# Altium schematic sheet FPGA.SchDoc
size A3; DocumentNumber: 4; Revision: B; SheetNumber: 4; SheetTotal: 7; SheetTitle: FPGA ICE40LP; Designer: DM; Reviewer: -
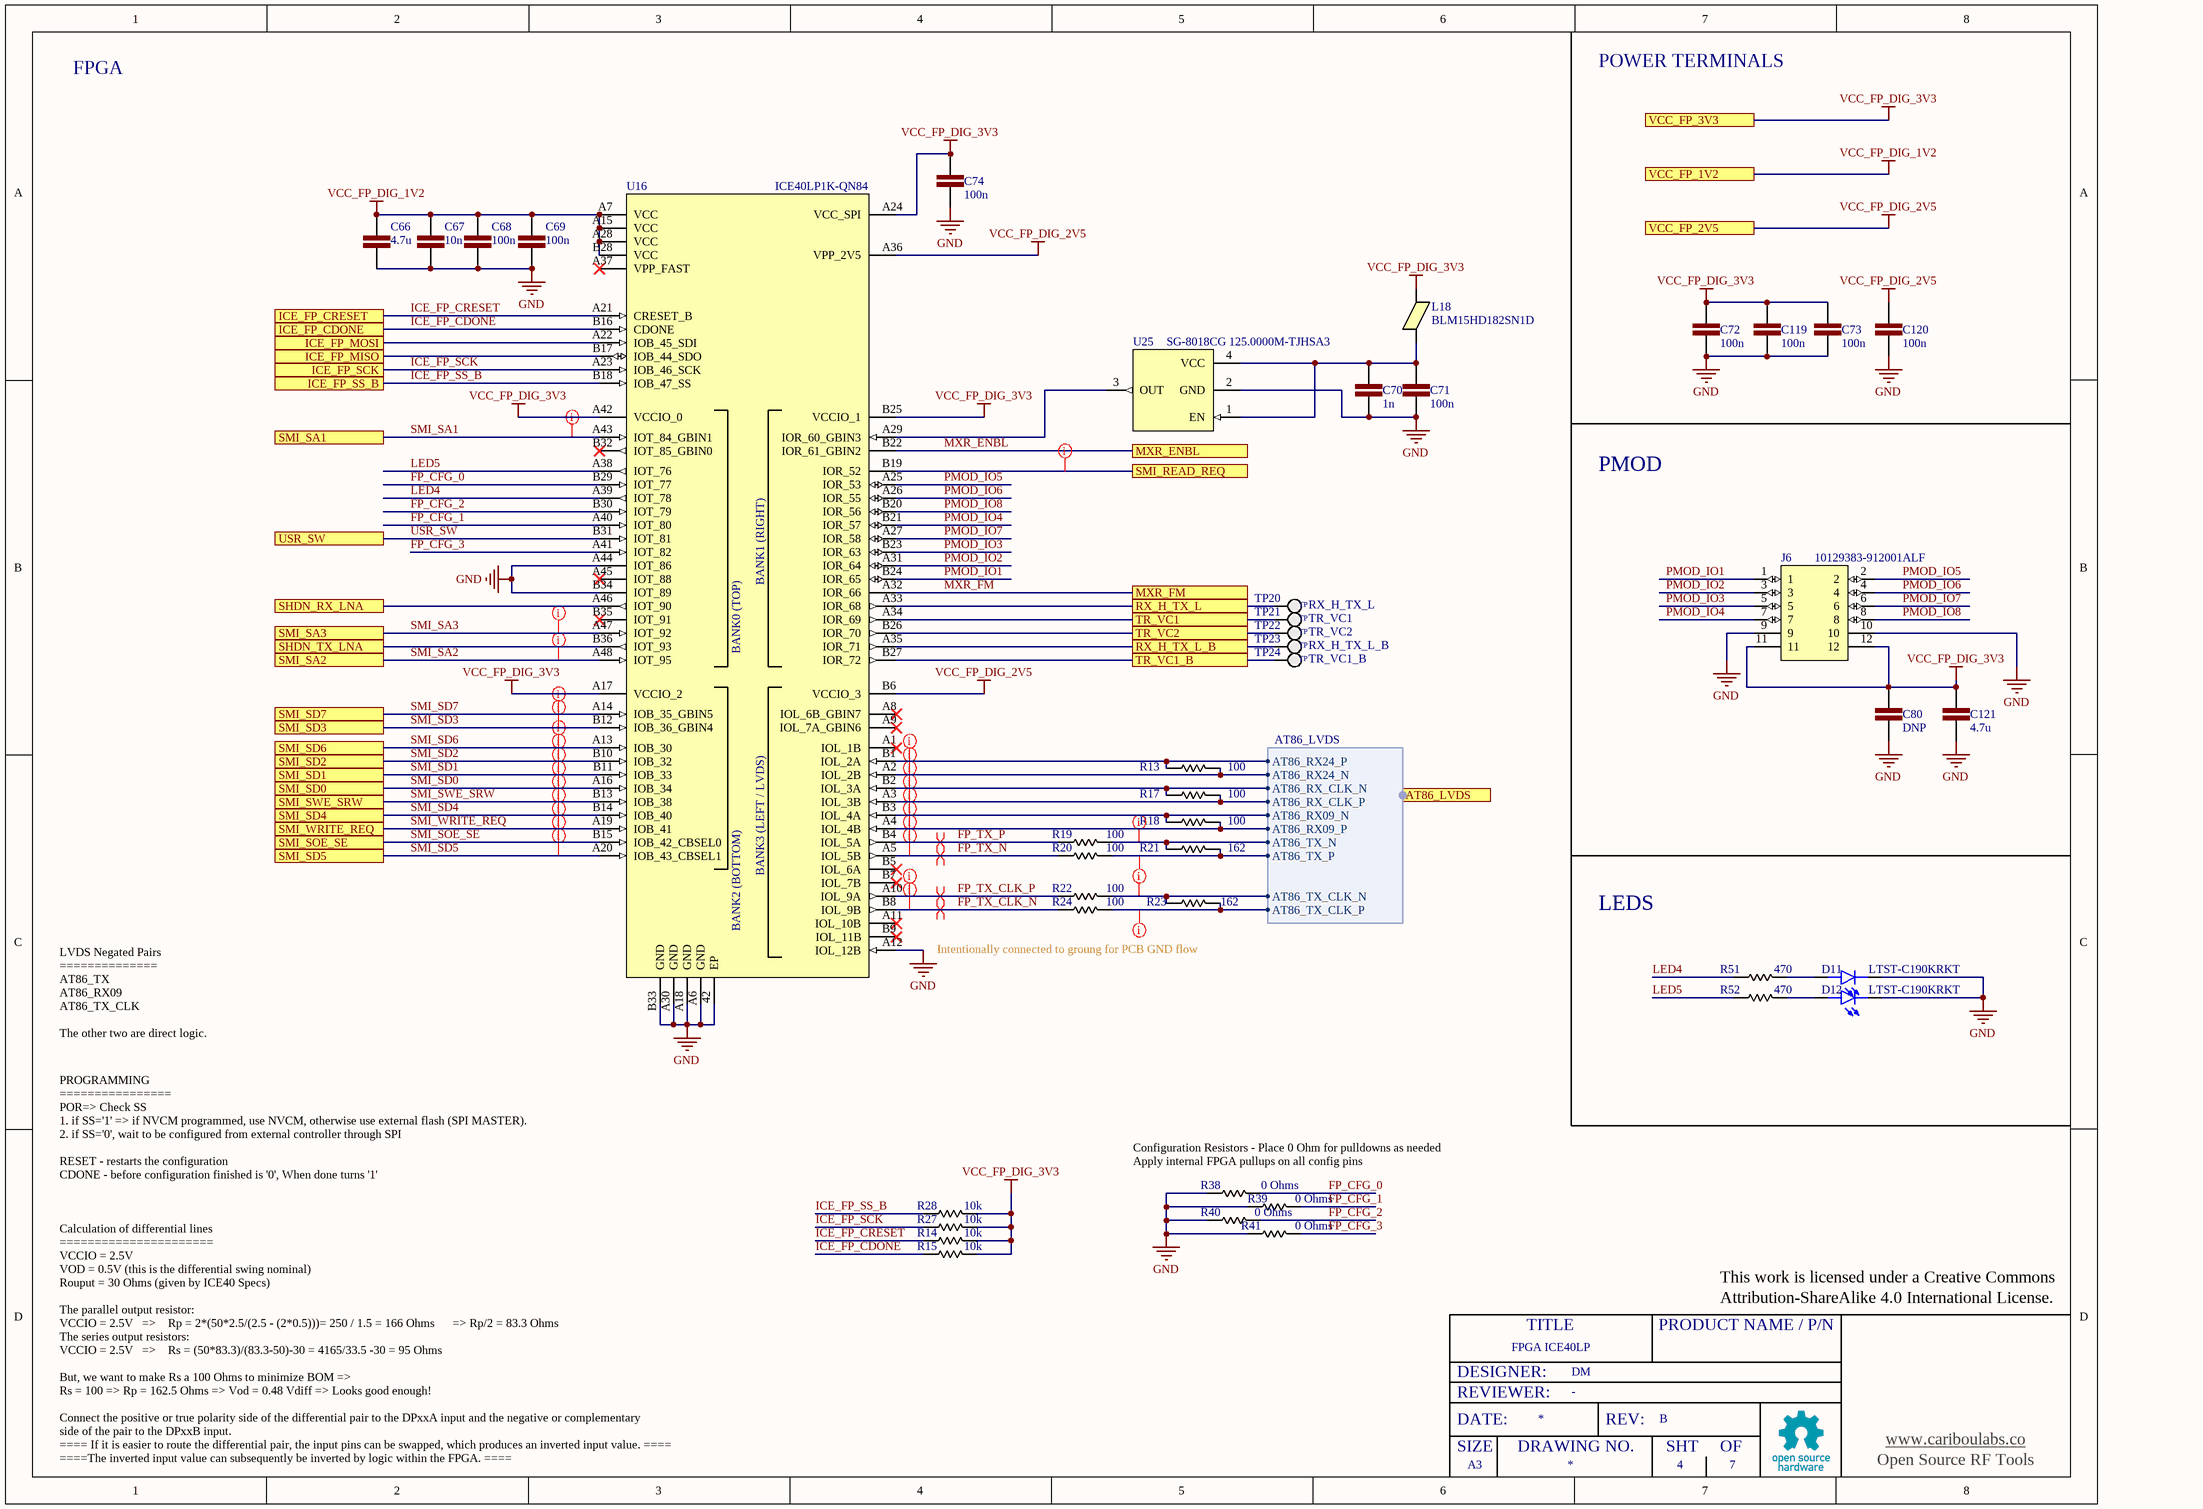
[diagram p0: FPGA.SchDoc]

## Parts
C66  4.7u  [MURATA 0402]
C67  10n  [MURATA 0402]
C68  100n  [MURATA 0402]
C69  100n  [MURATA 0402]
C70  1n  [MURATA 0402]
C71  100n  [MURATA 0402]
C72  100n  [MURATA 0402]
C73  100n  [MURATA 0402]
C74  100n  [MURATA 0402]
C80  DNP  [MURATA 0402]
C119  100n  [MURATA 0402]
C120  100n  [MURATA 0402]
C121  4.7u  [MURATA 0402]
D11  LTST-C190KRKT  [LEDC1608X35N]
D12  LTST-C190KRKT  [LEDC1608X35N]
J6  10129383-912001ALF  [10129383912001ALF]
L18  BLM15HD182SN1D  [0402 FERRITE BEAD]
R13  100  [PANASONIC 0402]
R14  10k  [PANASONIC 0402]
R15  10k  [PANASONIC 0402]
R17  100  [PANASONIC 0402]
R18  100  [PANASONIC 0402]
R19  100  [PANASONIC 0402]
R20  100  [PANASONIC 0402]
R21  162  [PANASONIC 0402]
R22  100  [PANASONIC 0402]
R23  162  [PANASONIC 0402]
R24  100  [PANASONIC 0402]
R27  10k  [PANASONIC 0402]
R28  10k  [PANASONIC 0402]
R38  0 Ohms  [PANASONIC 0402]
R39  0 Ohms  [PANASONIC 0402]
R40  0 Ohms  [PANASONIC 0402]
R41  0 Ohms  [PANASONIC 0402]
R51  470  [PANASONIC 0402]
R52  470  [PANASONIC 0402]
TP20  RX_H_TX_L  [TP_40]
TP21  TR_VC1  [TP_40]
TP22  TR_VC2  [TP_40]
TP23  RX_H_TX_L_B  [TP_40]
TP24  TR_VC1_B  [TP_40]
U16  ICE40LP1K-QN84  [LATTICE_ICE40LP1K-QN84]
U25  Manu. P/N: SG-8018CG 125.0000M-TJHSA3  [SG-8018CG]  (hidden comment: SG-8018CG 125.0000M-TJHPA3)

## Ports
AT86_LVDS (harness AT86_LVDS), ICE_FP_CDONE, ICE_FP_CRESET, ICE_FP_MISO, ICE_FP_MOSI, ICE_FP_SCK, ICE_FP_SS_B, MXR_ENBL, MXR_FM, RX_H_TX_L, RX_H_TX_L_B, SHDN_RX_LNA, SHDN_TX_LNA, SMI_READ_REQ, SMI_SA1, SMI_SA2, SMI_SA3, SMI_SD0, SMI_SD1, SMI_SD2, SMI_SD3, SMI_SD4, SMI_SD5, SMI_SD6, SMI_SD7, SMI_SOE_SE, SMI_SWE_SRW, SMI_WRITE_REQ, TR_VC1, TR_VC1_B, TR_VC2, USR_SW, VCC_FP_1V2, VCC_FP_2V5, VCC_FP_3V3

## Harnesses
AT86_LVDS: AT86_RX24_P, AT86_RX24_N, AT86_TX_P, AT86_TX_N, AT86_RX09_P, AT86_RX09_N, AT86_TX_CLK_N, AT86_TX_CLK_P, AT86_RX_CLK_P, AT86_RX_CLK_N

## Nets
GND: C66.2 C67.2 C68.1 C69.1 C70.1 C71.1 C72.2 C73.1 C74.1 C80.2 C119.2 C120.1 C121.2 D11.C D12.C J6.9 J6.10 R38.2 R39.2 R40.2 R41.2 U16.42(EP) U16.A6(GND) U16.A12(IOL_12B) U16.A18(GND) U16.A30(GND) U16.A44(IOT_86) U16.B33(GND) U16.B34(IOT_89) U25.2(GND)
VCC_FP_DIG_1V2: C66.1 C67.1 C68.2 C69.2 U16.A7(VCC) U16.A15(VCC) U16.A28(VCC) U16.B28(VCC) ; port VCC_FP_1V2
VCC_FP_DIG_2V5: C120.2 U16.A36(VPP_2V5) U16.B6(VCCIO_3) ; port VCC_FP_2V5
VCC_FP_DIG_3V3: C72.1 C73.2 C74.2 C80.1 C119.1 C121.1 J6.11 J6.12 L18.2 R14.2 R15.2 R27.2 R28.2 U16.A17(VCCIO_2) U16.A24(VCC_SPI) U16.A42(VCCIO_0) U16.B25(VCCIO_1) ; port VCC_FP_3V3
FP_CFG_0: R38.1 U16.B29(IOT_77)
FP_CFG_1: R39.1 U16.A40(IOT_80)
FP_CFG_2: R40.1 U16.B30(IOT_79)
FP_CFG_3: R41.1 U16.A41(IOT_82)
FP_TX_CLK_N: R24.1 U16.B8(IOL_9B)
FP_TX_CLK_P: R22.1 U16.A10(IOL_9A)
FP_TX_N: R20.1 U16.A5(IOL_5B)
FP_TX_P: R19.1 U16.B4(IOL_5A)
ICE_FP_CDONE: R15.1 U16.B16(CDONE) ; port ICE_FP_CDONE
ICE_FP_CRESET: R14.1 U16.A21(CRESET_B) ; port ICE_FP_CRESET
ICE_FP_MISO: U16.B17(IOB_44_SDO) ; port ICE_FP_MISO
ICE_FP_MOSI: U16.A22(IOB_45_SDI) ; port ICE_FP_MOSI
ICE_FP_SCK: R27.1 U16.A23(IOB_46_SCK) ; port ICE_FP_SCK
ICE_FP_SS_B: R28.1 U16.B18(IOB_47_SS) ; port ICE_FP_SS_B
LED4: R51.1 U16.A39(IOT_78)
LED5: R52.1 U16.A38(IOT_76)
MXR_ENBL: U16.B22(IOR_61_GBIN2) ; port MXR_ENBL
MXR_FM: U16.A32(IOR_66) ; port MXR_FM
PMOD_IO1: J6.1 U16.B24(IOR_65)
PMOD_IO2: J6.3 U16.A31(IOR_64)
PMOD_IO3: J6.5 U16.B23(IOR_63)
PMOD_IO4: J6.7 U16.B21(IOR_57)
PMOD_IO5: J6.2 U16.A25(IOR_53)
PMOD_IO6: J6.4 U16.A26(IOR_55)
PMOD_IO7: J6.6 U16.A27(IOR_58)
PMOD_IO8: J6.8 U16.B20(IOR_56)
RX_H_TX_L: TP20.1(TP) U16.A33(IOR_68) ; port RX_H_TX_L
RX_H_TX_L_B: TP23.1(TP) U16.A35(IOR_71) ; port RX_H_TX_L_B
SHDN_RX_LNA: U16.A46(IOT_90) ; port SHDN_RX_LNA
SHDN_TX_LNA: U16.B36(IOT_93) ; port SHDN_TX_LNA
SMI_READ_REQ: U16.B19(IOR_52) ; port SMI_READ_REQ
SMI_SA1: U16.A43(IOT_84_GBIN1) ; port SMI_SA1
SMI_SA2: U16.A48(IOT_95) ; port SMI_SA2
SMI_SA3: U16.A47(IOT_92) ; port SMI_SA3
SMI_SD0: U16.A16(IOB_34) ; port SMI_SD0
SMI_SD1: U16.B11(IOB_33) ; port SMI_SD1
SMI_SD2: U16.B10(IOB_32) ; port SMI_SD2
SMI_SD3: U16.B12(IOB_36_GBIN4) ; port SMI_SD3
SMI_SD4: U16.B14(IOB_40) ; port SMI_SD4
SMI_SD5: U16.A20(IOB_43_CBSEL1) ; port SMI_SD5
SMI_SD6: U16.A13(IOB_30) ; port SMI_SD6
SMI_SD7: U16.A14(IOB_35_GBIN5) ; port SMI_SD7
SMI_SOE_SE: U16.B15(IOB_42_CBSEL0) ; port SMI_SOE_SE
SMI_SWE_SRW: U16.B13(IOB_38) ; port SMI_SWE_SRW
SMI_WRITE_REQ: U16.A19(IOB_41) ; port SMI_WRITE_REQ
TR_VC1: TP21.1(TP) U16.A34(IOR_69) ; port TR_VC1
TR_VC1_B: TP24.1(TP) U16.B27(IOR_72) ; port TR_VC1_B
TR_VC2: TP22.1(TP) U16.B26(IOR_70) ; port TR_VC2
USR_SW: U16.B31(IOT_81) ; port USR_SW
NetC70_2: C70.2 C71.2 L18.1 U25.1(EN) U25.4(VCC)
NetD11_A: D11.A R51.2
NetD12_A: D12.A R52.2
NetR13_1: R13.1 U16.B1(IOL_2A) ; port AT86_LVDS.AT86_RX24_P
NetR13_2: R13.2 U16.A2(IOL_2B) ; port AT86_LVDS.AT86_RX24_N
NetR17_1: R17.1 U16.B2(IOL_3A) ; port AT86_LVDS.AT86_RX_CLK_N
NetR17_2: R17.2 U16.A3(IOL_3B) ; port AT86_LVDS.AT86_RX_CLK_P
NetR18_1: R18.1 U16.B3(IOL_4A) ; port AT86_LVDS.AT86_RX09_N
NetR18_2: R18.2 U16.A4(IOL_4B) ; port AT86_LVDS.AT86_RX09_P
NetR19_2: R19.2 R21.1 ; port AT86_LVDS.AT86_TX_N
NetR20_2: R20.2 R21.2 ; port AT86_LVDS.AT86_TX_P
NetR22_2: R22.2 R23.1 ; port AT86_LVDS.AT86_TX_CLK_N
NetR23_2: R23.2 R24.2 ; port AT86_LVDS.AT86_TX_CLK_P
NetU16_A29: U16.A29(IOR_60_GBIN3) U25.3(OUT)

Not connected (* = marked no-connect by the designer): U16 A1(IOL_1B)* A8(IOL_6B_GBIN7)* A9(IOL_7A_GBIN6)* A11(IOL_10B)* A37(VPP_FAST)* A45(IOT_88)* B5(IOL_6A)* B7(IOL_7B)* B9(IOL_11B)* B32(IOT_85_GBIN0)* B35(IOT_91)*

## Layout directives
differential pair: FP_TX_CLK_N, FP_TX_CLK_P, FP_TX_N, FP_TX_P
net class LVDS: FP_TX_CLK_N, FP_TX_CLK_P, FP_TX_N, FP_TX_P, NetR13_1, NetR13_2, NetR17_1, NetR17_2, NetR18_1, NetR18_2, NetR19_2, NetR20_2, NetR22_2, NetR23_2
net class SMI: SMI_READ_REQ, SMI_SA1, SMI_SA2, SMI_SA3, SMI_SD0, SMI_SD1, SMI_SD2, SMI_SD3, SMI_SD4, SMI_SD5, SMI_SD6, SMI_SD7, SMI_SOE_SE, SMI_SWE_SRW, SMI_WRITE_REQ

## Notes on the sheet
- FPGA
- POWER TERMINALS
- PMOD
- LEDS
- Intentionally connected to groung for PCB GND flow
- LVDS Negated Pairs
  ==============
  AT86_TX
  AT86_RX09
  AT86_TX_CLK
  The other two are direct logic.
- PROGRAMMING
  ================
  POR=> Check SS
  1. if SS='1' => if NVCM programmed, use NVCM, otherwise use external flash (SPI MASTER).
  2. if SS='0', wait to be configured from external controller through SPI
  RESET - restarts the configuration
  CDONE - before configuration finished is '0', When done turns '1'
- Configuration Resistors - Place 0 Ohm for pulldowns as needed
  Apply internal FPGA pullups on all config pins
- This work is licensed under a Creative Commons
- Attribution-ShareAlike 4.0 International License.
- Calculation of differential lines
  ======================
  VCCIO = 2.5V
  VOD = 0.5V (this is the differential swing nominal)
  Rouput = 30 Ohms (given by ICE40 Specs)
  The parallel output resistor:
  VCCIO = 2.5V   =>    Rp = 2*(50*2.5/(2.5 - (2*0.5)))= 250 / 1.5 = 166 Ohms      => Rp/2 = 83.3 Ohms
  The series output resistors:
  VCCIO = 2.5V   =>    Rs = (50*83.3)/(83.3-50)-30 = 4165/33.5 -30 = 95 Ohms
  But, we want to make Rs a 100 Ohms to minimize BOM =>
  Rs = 100 => Rp = 162.5 Ohms => Vod = 0.48 Vdiff => Looks good enough!
  Connect the positive or true polarity side of the differential pair to the DPxxA input and the negative or complementary
  side of the pair to the DPxxB input.
  ==== If it is easier to route the differential pair, the input pins can be swapped, which produces an inverted input value. ====
  ====The inverted input value can subsequently be inverted by logic within the FPGA. ====
- DESIGNER:
- REVIEWER:
- TITLE
- PRODUCT NAME / P/N
- SIZE
- DATE:
- DRAWING NO.
- REV:
- SHT
- OF
- www.cariboulabs.co
- A3
- Open Source RF Tools
- (in symbol ICE40LP1K-QN84) BANK0 (TOP); BANK1 (RIGHT); BANK2 (BOTTOM); BANK3 (LEFT / LVDS)

## Library data of the parts
C66 C121 = Capacitor: Multilayer Ceramic Capacitors MLCC - SMD/SMT 0402 MLCC X5R 4.7 uF +/ -20% 10V; Tolerance: 20%; Manu. P/N: GRJ155R61A475ME11J; Temp. Range: [-55, 85]; SRF: TBD [GHz]; Initial Voltage: 0; Vmax: 10V; Technology: X5R; VALUE: 4.7u
C67 = Capacitor: Multilayer Ceramic Capacitors MLCC - SMD/SMT 0402, 0.01UF 25V C0G; Tolerance: 5%; Manu. P/N: GRM1555C1E103JE01J; Temp. Range: [-55, 125]; SRF: TBD [GHz]; Initial Voltage: 0; Vmax: 25V; Technology: C0G; VALUE: 10n
C68 C69 C71-C74 C119 C120 = Capacitor: Multilayer Ceramic Capacitors MLCC - SMD/SMT 16V .1uF X5R 0402 10%; Manu. P/N: 0402YD104KAT2A; Temp. Range: [-55, 85]; SRF: TBD [GHz]; Initial Voltage: 0; Tolerance: 10%; Vmax: 16V; Technology: X5R; VALUE: 100n
C70 = Capacitor: Multilayer Ceramic Capacitors MLCC 1000pF ±5% 100V C0G 0402; Manu. P/N: GRM1555C2A102JE01D; Temp. Range: [-40, 125]; SRF: TBD [GHz]; Initial Voltage: 0; Tolerance: 5%; Vmax: 100V; Technology: C0G; VALUE: 1n
C80 = Capacitor: Multilayer Ceramic Capacitors MLCC - SMD/SMT 0402 MLCC X5R 4.7 uF +/ -20% 10V; Tolerance: 20%; Temp. Range: [-55, 85]; SRF: TBD [GHz]; Initial Voltage: 0; Vmax: 10V; Manu. P/N: DNP; Technology: X5R; VALUE: DNP
D11 D12 = LTST-C190KRKT: Red 631nm LED Indication - Discrete 2V 0603; Manu. P/N: LTST-C190KRKT
J6 = 10129383-912001ALF: Headers & Wire Housings ECONOSTIK HEADER DR VT SMT 2X6; Height: 8.58mm; Manu. P/N: 10129383-912001ALF
L18 = BLM15: Ferrite Beads 1800ohms GHz HiSpd; Imax: 0.2 A; Max DC Resistance: 2.2 Ohms; Temp. Range: [-40, 125]; Tolerance: 25%; Impedance @ 100 MHz: 1800 Ohms; Manu. P/N: BLM15HD182SN1D
R13 R17-R20 R22 R24 = Resistor: Thick Film Resistors - SMD 1/16watt 100ohms 1%; Manu. P/N: CRCW0402100RFKEDC; Power Rating: 62.5 mW (1/16 W); Temp. Ceoff.: 100 PPM / C; Tolerance: 1%; VALUE: 100
R14 R15 R27 R28 = Resistor: Thick Film Resistors - SMD 0402 1/16watt 10Kohms 1%; Manu. P/N: CRCW040210K0FKEDC; Power Rating: 62.5 mW (1/16 W); Temp. Ceoff.: 100 PPM/C; Tolerance: 1%; VALUE: 10k
R21 R23 = Resistor: Thick Film Resistors - SMD 1/16watt 162ohms 1%; Manu. P/N: CRCW0402162RFKED; Power Rating: 62.5 mW (1/16 W); Temp. Ceoff.: 100 PPM / C; Tolerance: 1%; VALUE: 162
R38-R41 = Resistor: Manu. P/N: CRCW04020000Z0EDC; Power Rating: 62.5 mW (1/16 W); Temp. Ceoff.: 100 PPM / C; Tolerance: 1%; Value: 0 Ohms
R51 R52 = Resistor: Thick Film Resistors - SMD 1/16watt 470ohms 1%; Manu. P/N: CRCW0402470RFKED; Power Rating: 62.5 mW (1/16 W); Temp. Ceoff.: 100 PPM / C; Tolerance: 1%; VALUE: 470
TP20-TP24 = TEST_POINT
U16 = ICE40LP1K-QN84: FPGA - Field Programmable Gate Array iCE40LP 1280 LUTs 1.2V Ultra Low-Power; Manu. P/N: ICE40LP1K-QN84
U25 = SG-8018CG 125.0000M-TJHPA3: Standard Clock Oscillators SG-8018CG 125.0000M-TJHPA3: MHZ OSC 1.8V 3.3V +/-50PPM -40 105C O/E 250TR; Alt2: ECS-2520MVQ-1250-BN-TR; Alt1: SG-8018CG 125.0000M-TJHPA3